# Altium schematic sheet Programmer.SchDoc
size A4; SheetNumber: 4; SheetTotal: 5
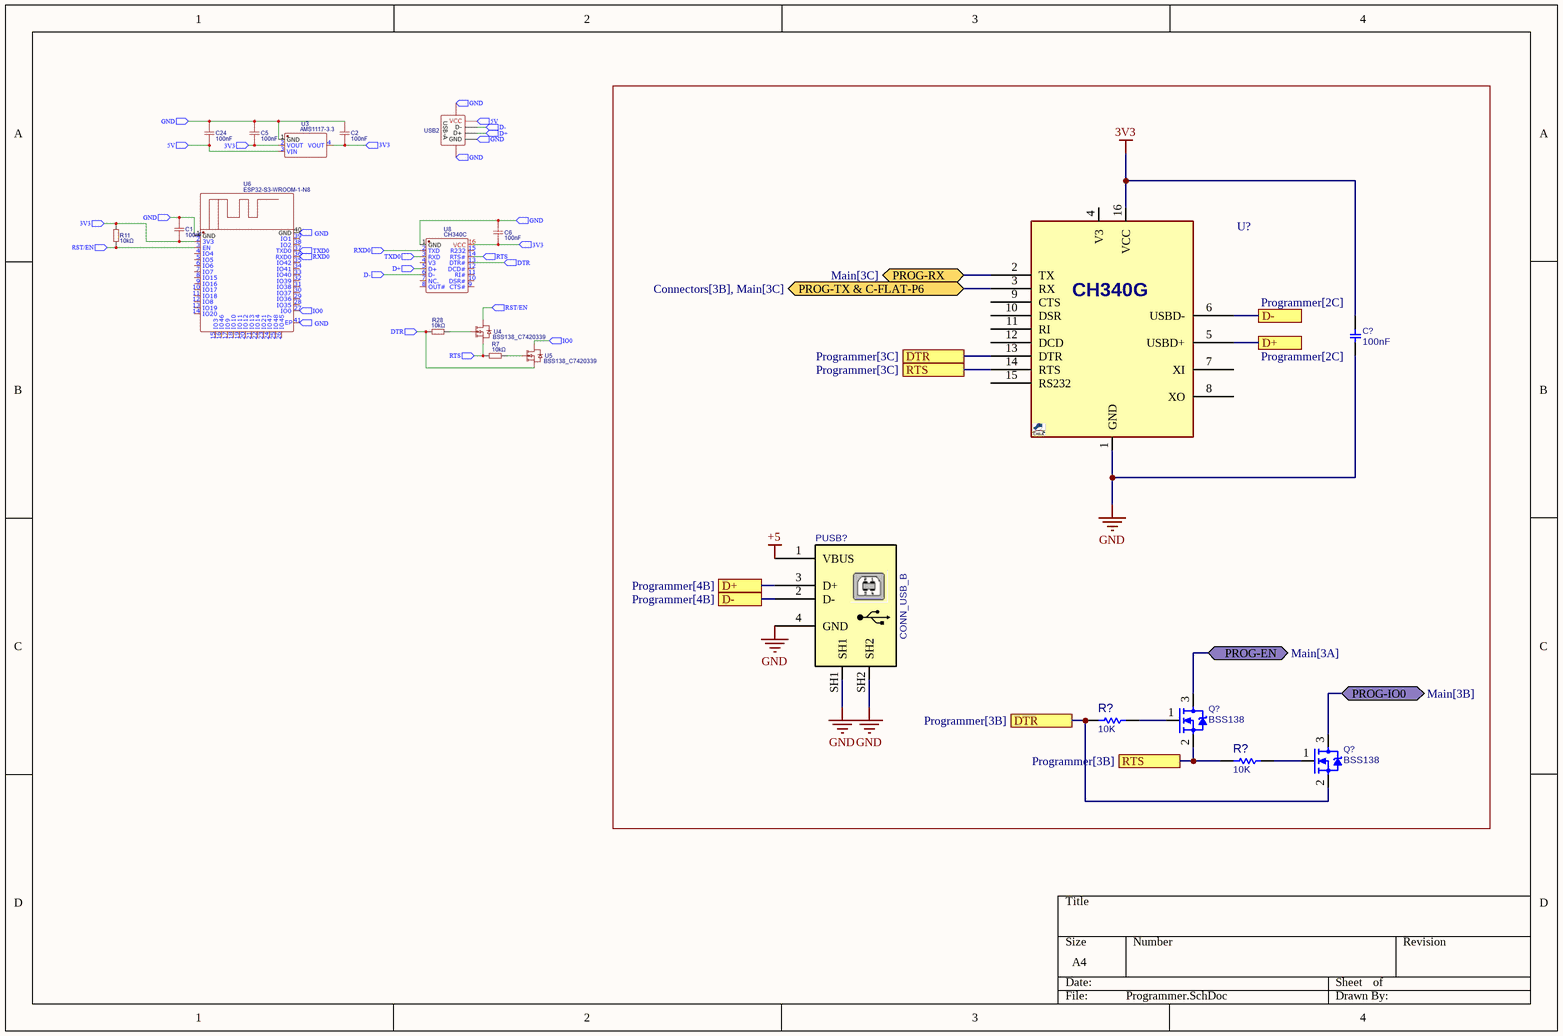
[diagram p0: Programmer.SchDoc]

## Parts
(Parts that share a designator on the sheet are numbered #1, #2 ... from top to bottom, then left to right.)
C?  100nF  [C0402]
PUSB?  CONN_USB_B  [USB_B_RA_THD]
Q?#1  BSS138  [SOT23_3]
Q?#2  BSS138  [SOT23_3]
R?#1  10K  [R0402]
R?#2  10K  [R0402]
U?  CH340G  [SO_16]  (value not drawn)

## Ports
D+ (see Programmer[2C]), D+ (see Programmer[4B]), D- (see Programmer[2C]), D- (see Programmer[4B]), DTR (see Programmer[3B]), DTR (see Programmer[3C]), PROG-EN (bidir, see Main[3A]), PROG-IO0 (bidir, see Main[3B]), PROG-RX (bidir, see Main[3C]), PROG-TX & C-FLAT-P6 (bidir, see Connectors[3B], Main[3C]), RTS (see Programmer[3B]), RTS (see Programmer[3C])

## Nets
3V3: C?.1 U?.16(VCC)
+5: PUSB?.1(VBUS)
GND: C?.2 PUSB?.4(GND) PUSB?.SH1 PUSB?.SH2 U?.1(GND)
D+: PUSB?.3(D+) U?.5(USBD+) ; port D+
D-: PUSB?.2(D-) U?.6(USBD-) ; port D-
DTR: Q?#2.2(SOURCE) R?#1.1 U?.13(DTR) ; port DTR
PROG-EN: Q?#1.3(DRAIN) ; port PROG-EN
PROG-IO0: Q?#2.3(DRAIN) ; port PROG-IO0
PROG-RX: U?.2(TX) ; port PROG-RX
PROG-TX & C-FLAT-P6: U?.3(RX) ; port PROG-TX & C-FLAT-P6
RTS: Q?#1.2(SOURCE) R?#2.1 U?.14(RTS) ; port RTS
NetQ?#1_1: Q?#1.1(GATE) R?#1.2
NetQ?#2_1: Q?#2.1(GATE) R?#2.2

Not connected (* = marked no-connect by the designer): U? 4(V3) 7(XI) 8(XO) 9(CTS) 10(DSR) 11(RI) 12(DCD) 15(RS232)

## Library data of the parts
C? = CAP_SMD_MLCC: CAP, MLCC; PARAM: C0G, 10%; DESC: CAP, MLCC, 1nF, 50V, C0G, 10%, 0402; MANF_P#: MANF_PART#; MANF: Murata; PARAM2: 50V; PRICE: 100= 1$; ASSEMBLY: ASSEMBLY; VALUE: 100nF
PUSB? = CONN_USB_B_RA_THD: CONN, USB, B, R/A, THD; MANF_P#: 292304-1; MANF: TE Connectivity; VALUE: CONN_USB_B
Q?#1 Q?#2 = MOSN_BSS138_SOT23: MOSFET Nchan 50V 200mA; MANF_P#: BSS138-7-F; MANF: Diodes Inc.; DESC: MOSFET Nchan 50V 200mA; PRICE: 0.18; ASSEMBLY: ASSEMBLY; VALUE: BSS138
R?#1 R?#2 = RES_SMD: RESISTOR, SMD; PARAM: -W; DESC: DESCRIPTION; DIST#: MOUSER; PARAM2: 1%; MANF_P#: -; MANF: -; ASSEMBLY: ASSEMBLY; PRICE: 100= 0.5$; VALUE: 10K
U? = CH340G_SOP16: USB-UART; MANF_P#: CH340G; VALUE: CH340G; PACKAGE: SOP-16